# Altium schematic sheet USBHUB_USB2512.SchDoc
size A4
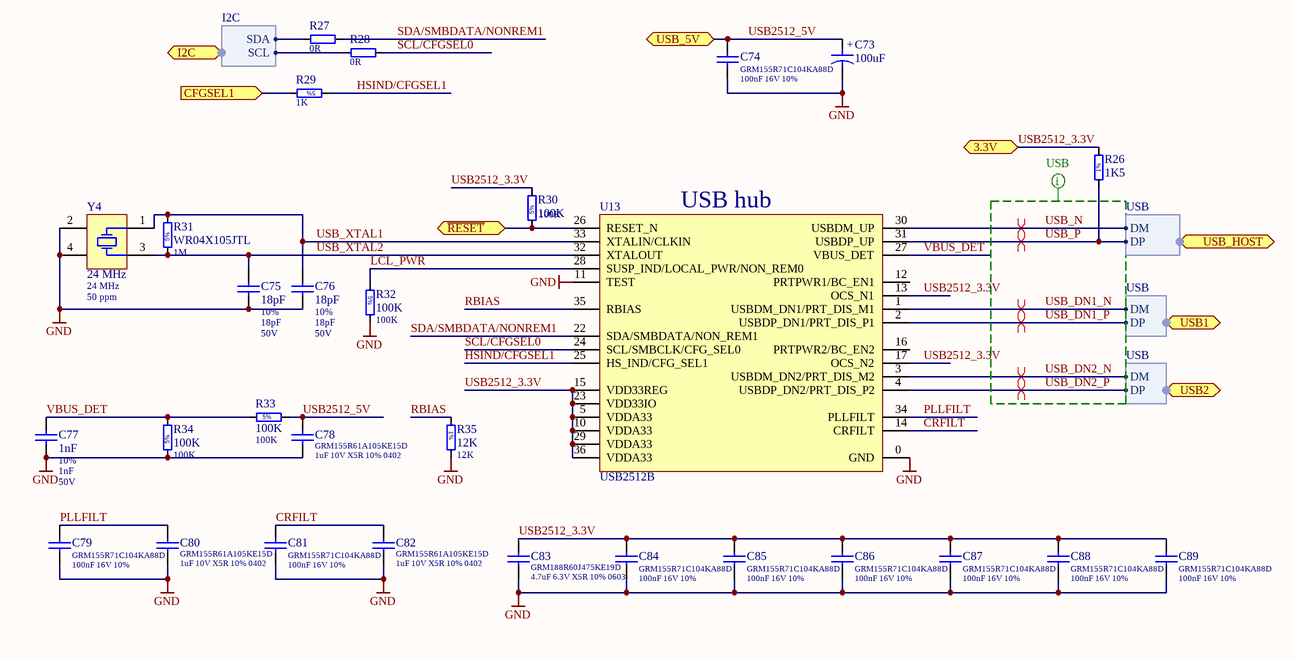
[diagram p0: USBHUB_USB2512.SchDoc]

## Parts
C73  100uF  [C]
C74  GRM155R71C104KA88D  value 100nF 16V 10%  [0402]
C75  18pF  Tolerance: 10%  Voltage: 50V  [0402C]
C76  18pF  Tolerance: 10%  Voltage: 50V  [0402C]
C77  1nF  Tolerance: 10%  Voltage: 50V  [0402C]
C78  GRM155R61A105KE15D  value 1uF 10V X5R 10% 0402  [0402]
C79  GRM155R71C104KA88D  value 100nF 16V 10%  [0402]
C80  GRM155R61A105KE15D  value 1uF 10V X5R 10% 0402  [0402]
C81  GRM155R71C104KA88D  value 100nF 16V 10%  [0402]
C82  GRM155R61A105KE15D  value 1uF 10V X5R 10% 0402  [0402]
C83  GRM188R60J475KE19D  value 4.7uF 6.3V X5R 10% 0603  [0603]
C84  GRM155R71C104KA88D  value 100nF 16V 10%  [0402]
C85  GRM155R71C104KA88D  value 100nF 16V 10%  [0402]
C86  GRM155R71C104KA88D  value 100nF 16V 10%  [0402]
C87  GRM155R71C104KA88D  value 100nF 16V 10%  [0402]
C88  GRM155R71C104KA88D  value 100nF 16V 10%  [0402]
C89  GRM155R71C104KA88D  value 100nF 16V 10%  [0402]
R26  1K5  [0402R]
R27  value 0R  [0402R]  (hidden comment: Resistor jumper)
R28  value 0R  [0402R]  (hidden comment: Resistor jumper)
R29  1K  [0402R]
R30  100K  [0402R]
R31  WR04X105JTL  value 1M  [0402R]
R32  100K  [0402R]
R33  100K  [0402R]
R34  100K  [0402R]
R35  12K  [0402R]
U13  USB2512B  [QFN-36-0.5-6x6_TP_5class]
Y4  24 MHz  Tolerance: 50 ppm  [2025]

## Ports
3.3V (bidir), CFGSEL1 (in), I2C (harness I2C), USB1 (harness USB), USB2 (harness USB), USB_5V (bidir), USB_HOST (harness USB), ~{RESET} (bidir)

## Harnesses
USB: DP, DM
I2C: SDA, SCL
USB: DM, DP

## Nets
GND: C73.2 C74.2 C75.1 C76.1 C77.1 C78.2 C79.2 C80.2 C81.2 C82.2 C83.2 C84.2 C85.2 C86.2 C87.2 C88.2 C89.2 R32.2 R34.1 R35.2 U13.0(GND) U13.11(TEST) Y4.2(GND) Y4.4(GND)
CFGSEL1: R29.2 ; port CFGSEL1
CRFILT: C81.1 C82.1 U13.14(CRFILT)
HSIND/CFGSEL1: R29.1 U13.25(HS_IND/CFG_SEL1)
LCL_PWR: R32.1 U13.28(SUSP_IND/LOCAL_PWR/NON_REM0)
PLLFILT: C79.1 C80.1 U13.34(PLLFILT)
~{RESET}: R30.1 U13.26(RESET_N) ; port ~{RESET}
RBIAS: R35.1 U13.35(RBIAS)
SCL/CFGSEL0: R28.2 U13.24(SCL/SMBCLK/CFG_SEL0)
SDA/SMBDATA/NONREM1: R27.2 U13.22(SDA/SMBDATA/NON_REM1)
USB2512_3.3V: C83.1 C84.1 C85.1 C86.1 C87.1 C88.1 C89.1 R26.2 R30.2 U13.5(VDDA33) U13.10(VDDA33) U13.13(OCS_N1) U13.15(VDD33REG) U13.17(OCS_N2) U13.23(VDD33IO) U13.29(VDDA33) U13.36(VDDA33) ; port 3.3V
USB2512_5V: C73.1 C74.1 C78.1 R33.2 ; port USB_5V
USB_DN1_N: U13.1(USBDM_DN1/PRT_DIS_M1) ; port USB1.DM
USB_DN1_P: U13.2(USBDP_DN1/PRT_DIS_P1) ; port USB1.DP
USB_DN2_N: U13.3(USBDM_DN2/PRT_DIS_M2) ; port USB2.DM
USB_DN2_P: U13.4(USBDP_DN2/PRT_DIS_P2) ; port USB2.DP
USB_N: U13.30(USBDM_UP) ; port USB_HOST.DM
USB_P: R26.1 U13.31(USBDP_UP) ; port USB_HOST.DP
USB_XTAL1: C76.2 R31.2 U13.33(XTALIN/CLKIN) Y4.1(X)
USB_XTAL2: C75.2 R31.1 U13.32(XTALOUT) Y4.3(X)
VBUS_DET: C77.2 R33.1 R34.2 U13.27(VBUS_DET)
NetR27_1: R27.1 ; port I2C.SDA
NetR28_1: R28.1 ; port I2C.SCL

Not connected (* = marked no-connect by the designer): U13 12(PRTPWR1/BC_EN1) 16(PRTPWR2/BC_EN2)

## Layout directives
net class USB: USB_DN1_N, USB_DN1_P, USB_DN2_N, USB_DN2_P, USB_N, USB_P
differential pair: USB_DN1_N, USB_DN1_P, USB_DN2_N, USB_DN2_P, USB_N, USB_P

## Notes on the sheet
- (near U13) USB hub
- (in symbol CapacitorTANT) +

## Library data of the parts
C73 = CapacitorTANT: Polarized capacitor; Voltage: 50V; Tolerance: 10%; Value: 100uF
C74 C79 C81 C84-C89 = Capacitor ceramic: Ceramic capacitor; Voltage: 16V; Tolerance: 10%; Capacitance: 100nF
C75-C77 = Capacitor ceramic: Ceramic capacitor
  C75 C76: Value: 18pF
  C77: Value: 1nF
C78 C80 C82 = Capacitor ceramic: Ceramic capacitor; Voltage: 10V; Tolerance: 10%; Capacitance: 1uF; Dielectric: X5R
C83 = Capacitor ceramic: Ceramic capacitor; Voltage: 6.3V; Tolerance: 10%; Capacitance: 4.7uF; Dielectric: X5R
R26 = Resistor 1%: Thin Film Chip Resistor; Power: 0.1 W; Tolerance: 1%; Value: 1K5
R27 R28 = Resistor jumper: Thin Film Resistor Jumper; Power: 0.1 W
R29-R34 = Resistor: Thin Film Chip Resistor; Power: 0.1 W; Tolerance: 5%
  R29: Value: 1K
  R30 R32-R34: Value: 100K
R35 = Resistor: Thin Film Chip Resistor; Power: 0.1 W; Tolerance: 1%; Value: 12K
U13 = USB2512B: USB 2.0 Hi-Speed Hub Controller; HelpURL: http://ww1.microchip.com/downloads/en/DeviceDoc/00001692C.pdf
Y4 = Quartz crystal: Value: 24 MHz; Datasheet: http://geyer-electronic.de/uploads/tx_userartikelfrequenz/GEYER-KX-9A_01.pdf; Supplier: http://www.compel.ru/infosheet/GEYER/KX-9A%208.0%20MHz; Price(1): 0.6809; Price(100): 0.454